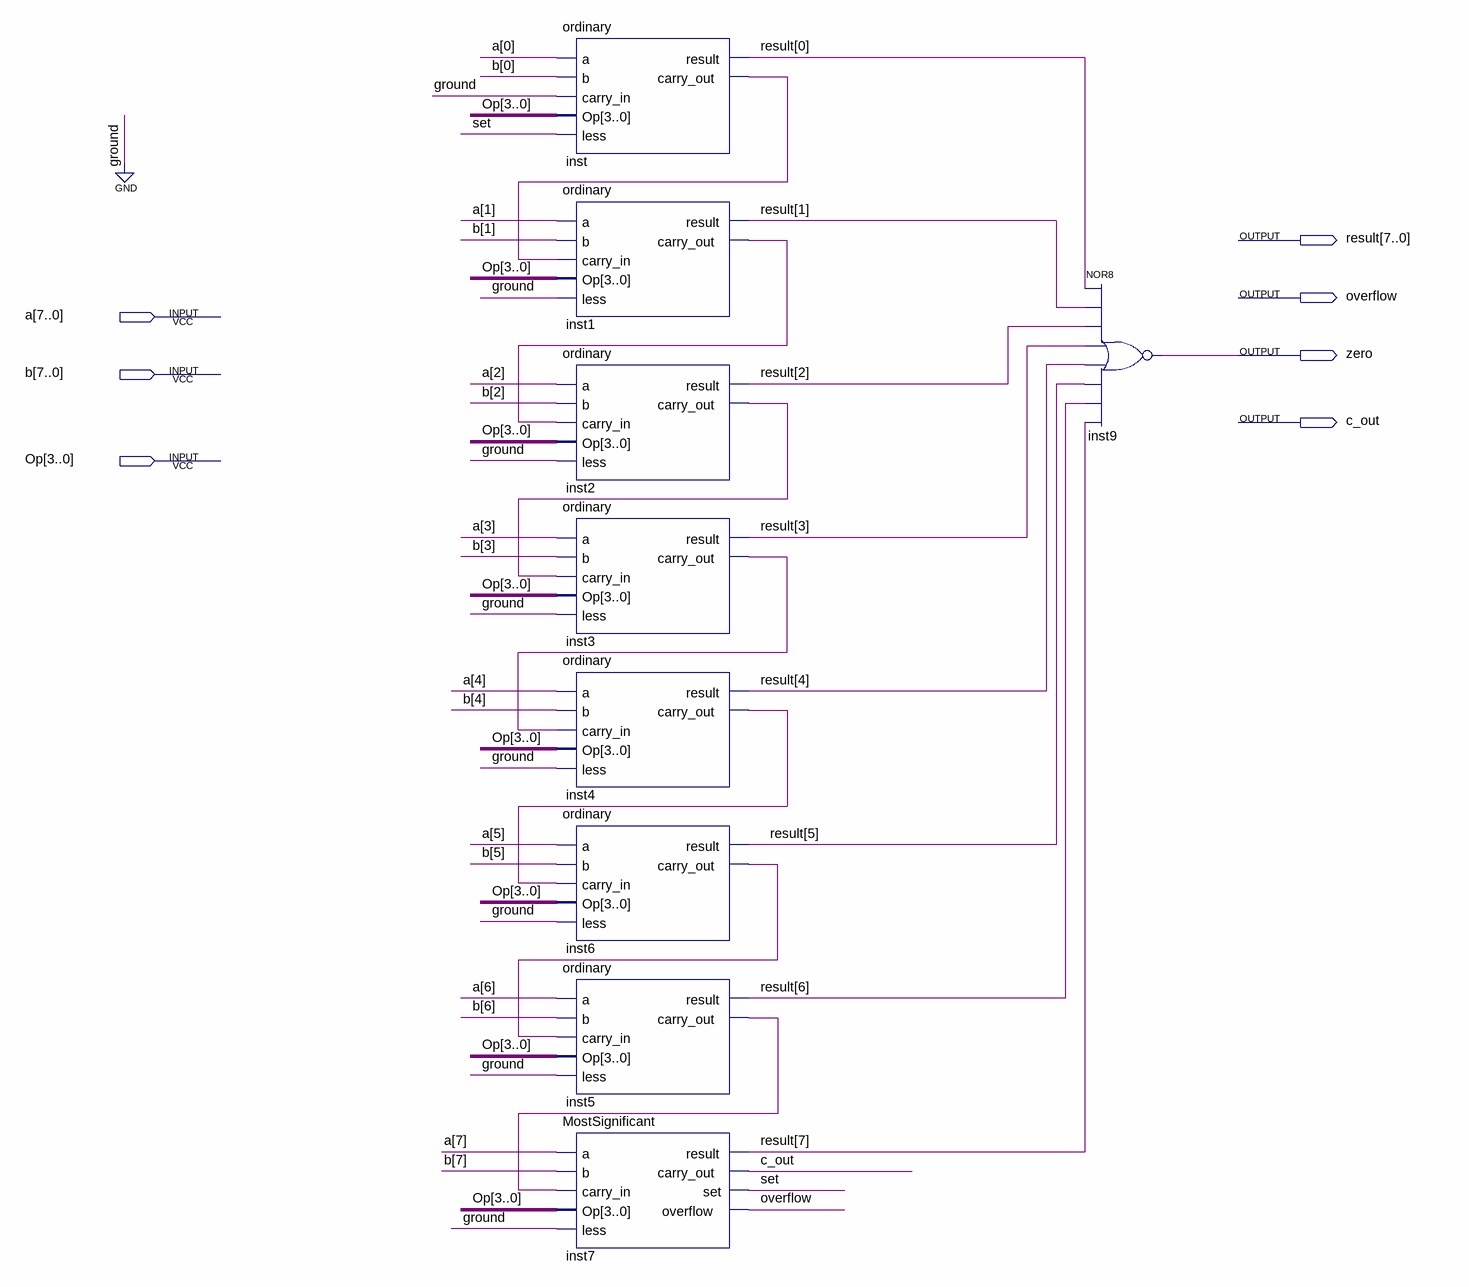
[diagram p0: schematic sheet]
// Quartus schematic ALU.bdf as structural Verilog: 9 symbols, 7 pins
module ALU (
  input  [7:0] a,
  input  [7:0] b,
  input  [3:0] Op,
  output [7:0] result,
  output overflow,
  output zero,
  output c_out
);

  wire inst1_carry_out, inst2_carry_out, inst3_carry_out, inst4_carry_out, inst5_carry_out, inst6_carry_out,
       inst_carry_out, set;

  ordinary inst (
    .a(a[0]), .b(b[0]), .carry_in(1'b0), .Op(Op), .less(set), .result(result[0]), .carry_out(inst_carry_out));
  ordinary inst1 (
    .a(a[1]), .b(b[1]), .carry_in(inst_carry_out), .Op(Op), .less(1'b0), .result(result[1]),
    .carry_out(inst1_carry_out));
  ordinary inst2 (
    .a(a[2]), .b(b[2]), .carry_in(inst1_carry_out), .Op(Op), .less(1'b0), .result(result[2]),
    .carry_out(inst2_carry_out));
  ordinary inst3 (
    .a(a[3]), .b(b[3]), .carry_in(inst2_carry_out), .Op(Op), .less(1'b0), .result(result[3]),
    .carry_out(inst3_carry_out));
  ordinary inst4 (
    .a(a[4]), .b(b[4]), .carry_in(inst3_carry_out), .Op(Op), .less(1'b0), .result(result[4]),
    .carry_out(inst4_carry_out));
  ordinary inst6 (
    .a(a[5]), .b(b[5]), .carry_in(inst4_carry_out), .Op(Op), .less(1'b0), .result(result[5]),
    .carry_out(inst6_carry_out));
  ordinary inst5 (
    .a(a[6]), .b(b[6]), .carry_in(inst6_carry_out), .Op(Op), .less(1'b0), .result(result[6]),
    .carry_out(inst5_carry_out));
  MostSignificant inst7 (
    .a(a[7]), .b(b[7]), .carry_in(inst5_carry_out), .Op(Op), .less(1'b0), .result(result[7]),
    .carry_out(c_out), .set(set), .overflow(overflow));
  nor inst9 (zero, result[0], result[1], result[2], result[3], result[4], result[5], result[6], result[7]);
endmodule
